# EAGLE design Telecomanda_Licenta (EAGLE 9.6.2)
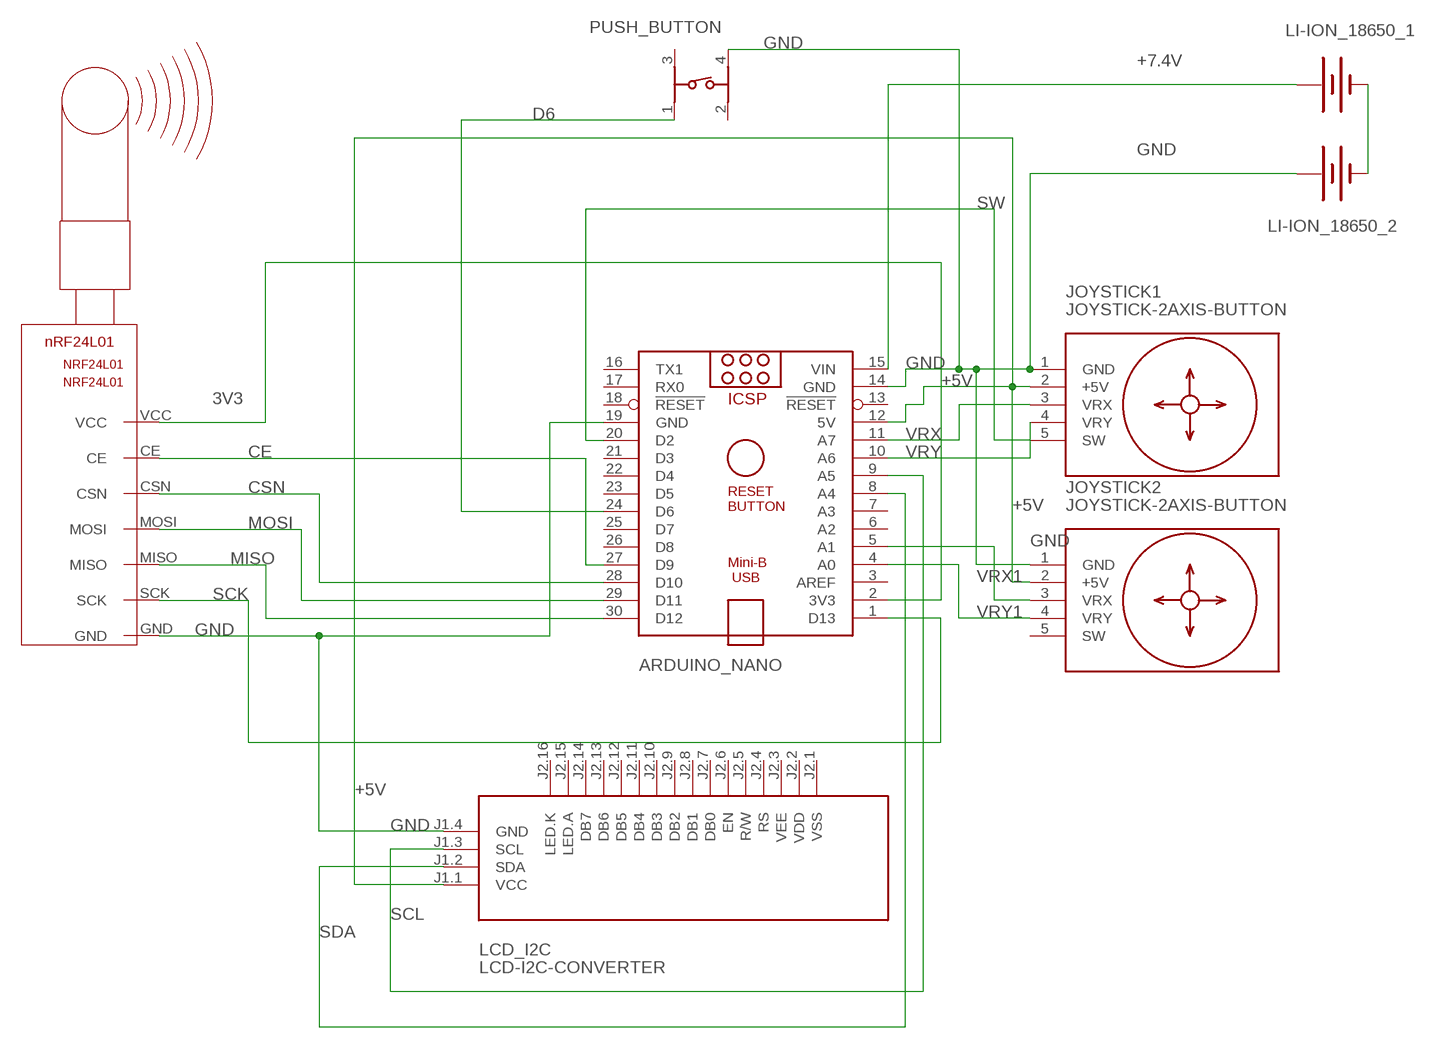
[diagram p0: schematic, sheet 1]

## Parts
ARDUINO_NANO  ARDUINO_NANO  [ARDUINO_NANO]
JOYSTICK1  JOYSTICK-2AXIS-BUTTON  [JOYSTICK-2AXIS-BUTTON]
JOYSTICK2  JOYSTICK-2AXIS-BUTTON  [JOYSTICK-2AXIS-BUTTON]
LCD_I2C  LCD-I2C-CONVERTER  [LCD-I2C-CONVERTER]
LI-ION_18650_1  BATTERY-18650  [BATTERY_18650-HOLDER]
LI-ION_18650_2  BATTERY-18650  [BATTERY_18650-HOLDER]
NRF24L01  NRF24L01  [NRF24L01]
PUSH_BUTTON  430152050836  [430152050836]

## Nets
3V3: ARDUINO_NANO.2(3V3) NRF24L01.VCC
+5V: ARDUINO_NANO.12(5V) JOYSTICK1.2(+5V) JOYSTICK2.2(+5V) LCD_I2C.J1.1(VCC)
+7.4V: ARDUINO_NANO.15(VIN) LI-ION_18650_1.PWR@1(+)
CE: ARDUINO_NANO.27(D9) NRF24L01.CE
CSN: ARDUINO_NANO.28(D10) NRF24L01.CSN
D6: ARDUINO_NANO.24(D6) PUSH_BUTTON.1
GND: ARDUINO_NANO.14(GND) ARDUINO_NANO.19(GND) JOYSTICK1.1(GND) JOYSTICK2.1(GND) LCD_I2C.J1.4(GND) LI-ION_18650_2.PWR@1(+) NRF24L01.GND PUSH_BUTTON.4
MISO: ARDUINO_NANO.30(D12) NRF24L01.MISO
MOSI: ARDUINO_NANO.29(D11) NRF24L01.MOSI
N$19: LI-ION_18650_1.GND@1(-) LI-ION_18650_2.GND@1(-)
SCK: ARDUINO_NANO.1(D13) NRF24L01.SCK
SCL: ARDUINO_NANO.9(A5) LCD_I2C.J1.3(SCL)
SDA: ARDUINO_NANO.8(A4) LCD_I2C.J1.2(SDA)
SW: ARDUINO_NANO.20(D2) JOYSTICK1.5(SW)
VRX: ARDUINO_NANO.11(A7) JOYSTICK1.3(VRX)
VRX1: ARDUINO_NANO.5(A1) JOYSTICK2.3(VRX)
VRY: ARDUINO_NANO.10(A6) JOYSTICK1.4(VRY)
VRY1: ARDUINO_NANO.4(A0) JOYSTICK2.4(VRY)
Unconnected: ARDUINO_NANO.3(AREF) ARDUINO_NANO.6(A2) ARDUINO_NANO.7(A3) ARDUINO_NANO.13(!RESET) ARDUINO_NANO.16(TX1) ARDUINO_NANO.17(RX0) ARDUINO_NANO.18(!RESET) ARDUINO_NANO.21(D3) ARDUINO_NANO.22(D4) ARDUINO_NANO.23(D5) ARDUINO_NANO.25(D7) ARDUINO_NANO.26(D8) JOYSTICK2.5(SW) LCD_I2C.J2.1(VSS) LCD_I2C.J2.2(VDD) LCD_I2C.J2.3(VEE) LCD_I2C.J2.4(RS) LCD_I2C.J2.5(R/W) LCD_I2C.J2.6(EN) LCD_I2C.J2.7(DB0) LCD_I2C.J2.8(DB1) LCD_I2C.J2.9(DB2) LCD_I2C.J2.10(DB3) LCD_I2C.J2.11(DB4) LCD_I2C.J2.12(DB5) LCD_I2C.J2.13(DB6) LCD_I2C.J2.14(DB7) LCD_I2C.J2.15(LED.A) LCD_I2C.J2.16(LED.K) PUSH_BUTTON.2 PUSH_BUTTON.3

## Library data of the parts
ARDUINO_NANO = ArduinoNanoV30:ARDUINO_NANO: Arduino Nano V3.0 Overview: The Arduino Nano is a small, complete, and breadboard-friendly board based on the ATmega328 (Arduino Nano 3.x) or ATmega168 (Arduino Nano 2.x). It has more or less the same functionality of the Arduino Duemilanove, but in a different package. It lacks only a DC power jack, and works with a Mini-B USB cable instead of a standard one. The Nano was designed and is being produced by Gravitech. Specifications: Microcontroller Atmel ATmega168 or ATmega328 Operating Voltage (logic level) 5 V Input Voltage (recommended) 7-12 V Input Voltage (limits) 6-20 V Digital I/O Pins 14 (of which 6 provide PWM output) Analog Input Pins 8 DC Current per I/O Pin 40 mA Flash Memory 16 KB (ATmega168) or 32 KB (ATmega328) of which 2 KB used by bootloader SRAM 1 KB (ATmega168) or 2 KB (ATmega328) EEPROM 512 bytes (ATmega168) or 1 KB (ATmega328) Clock Speed 16 MHz Dimensions 0.73" x 1.70" Length 45 mm Width 18 mm Weigth 5 g Power: The Arduino Nano can be powered via the Mini-B USB connection, 6-20V unregulated external power supply (pin 30), or 5V regulated external power supply (pin 27). The power source is automatically selected to the highest voltage source. Memory: The ATmega168 has 16 KB of flash memory for storing code (of which 2 KB is used for the bootloader); the ATmega328 has 32 KB, (also with 2 KB used for the bootloader). The ATmega168 has 1 KB of SRAM and 512 bytes of EEPROM (which can be read and written with the EEPROM library); the ATmega328 has 2 KB of SRAM and 1 KB of EEPROM. Input and Output: Each of the 14 digital pins on the Nano can be used as an input or output, using pinMode(), digitalWrite(), and digitalRead() functions. They operate at 5 volts. Each pin can provide or receive a maximum of 40 mA and has an internal pull-up resistor (disconnected by default) of 20-50 kOhms. In addition, some pins have specialized functions. Visit Arduino - ArduinoBoardNano <https://www.arduino.cc/en/Main/ArduinoBoardNano>
JOYSTICK1 JOYSTICK2 = diy-modules (3):JOYSTICK-2AXIS-BUTTON: 2-Axis Analog Joystick with Push Button Tutorial is available here: http://henrysbench.capnfatz.com/henrys-bench/arduino-sensors-and-input/arduino-ps2-joystick-tutorial-keyes-ky-023-deek-robot/ Click here to find device on ebay.com <http://www.ebay.com/sch/joystick+ps2+module>
LCD_I2C = diy-modules (3):LCD-I2C-CONVERTER: I2C Bus to 4-Bit Parallel LCD Interface with LED backlight driver
LI-ION_18650_1 LI-ION_18650_2 = SparkFun-Batteries:BATTERY: Battery - Single Cell A variety of battery chemistries, sizes, and footprints. Device List: 20MM_PTH - Coin Cell Battery Holder - 20mm (PTH) <https://www.sparkfun.com/products/783> 6.8MM_PTH - Coin Cell Battery Holder - 6.8MM(SMD) <https://www.digikey.com/product-detail/en/seiko-instruments/MS621FE-FL11E/728-1057-ND/1889208?WT.srch=1&gclid=CNOQ5a6LzdQCFZS2wAodXCkE0g> 12MM_SMD - Coin Cell Battery Holder - 12mm (SMD) <https://www.sparkfun.com/products/10592> 12MM_PTH - Coin Cell Battery Holder - 12mm (PTH) <https://www.sparkfun.com/products/7948> 20MM_SMD - 20mm Coin Cell Battery Holder (SMD) (2 legs) Used on the Big Time Watch Kit <https://www.sparkfun.com/products/11734> 20MM_SMD_4LEGS - Coin Cell Battery Holder - 20mm (SMD) <https://www.sparkfun.com/products/11892> 20MM_SMD_4LEGS_OVERPASTE - Coin Cell Battery Holder - 20mm (SMD) <https://www.sparkfun.com/products/11892> (Over-paste on the legs) 24.5MM_PTH - Coin Cell Battery Holder - 24.5mm (PTH) <https://www.sparkfun.com/products/8863> 9V - 9V Battery Holder - PC Mount Used on the SparkFun SparkPunk Sound Kit <https://www.sparkfun.com/products/11177> and SparkFun SparkPunk Sequencer Kit <https://www.sparkfun.com/products/12707> 18650 - Battery Holder - 18650 (PTH) <https://www.sparkfun.com/products/13113> AA - Battery Holder - 1xAA (PTH) <https://www.sparkfun.com/products/7949> AAA - Battery Holder - 1xAAA (PTH) <https://www.sparkfun.com/products/12718> AA_KIT - Battery Holder - 1xAA (PTH) <https://www.sparkfun.com/products/7949> Special kit package - pads only have exposed copper on one side of the board. AAA_KIT - Battery Holder - 1xAAA (PTH) <https://www.sparkfun.com/products/12718> Special kit package - pads only have exposed copper on one side of the board.; PROD_ID: BATT-12327; SF_SKU: PRT-13113
NRF24L01 = Clean-Kong (1):NRF24L01: nrF54L01 2.4GHz with 100 Channels Emitter/Reveiver SPI Controlled Roboshop / Minint
PUSH_BUTTON = Wurth_Switch_WS-TASV:430152050836: WS-TASV SMT Tact Switch 6x6 mm Material Properties Cover Material : Stainless Steel Properties Actuator Material:LCP Actuator Flammability :UL94 V-0 Rating Actuator Color:Black; Salmon; White Frame Material:LCP Flammability Rating:UL94 V-0 Frame Color:Black Contact Material:Stainless Steel Contact Plating:Silver Terminal Material:Copper Alloy Terminal Plating:Silver VR:12 V (DC) Contact Resistance Initial:100 mΩ Contact Resistance After Life Test:2Ω RISO:100 MΩ Withstanding Voltage:250 V (AC) Washable:No Qty.:4000;5000 Mechanical Properties Electrical Life:400; 550; 1000 Stroke :0.25 mm General Information Operating Temperature:-40 up to +85 °C Washable:No Packaging Properties Packaging:Tape and Reel <https://www.we-online.com/catalog/media/o37470v209%20Family_WS-TASV_6x6mm_SMD_Tact_Switch_4301820xx8xx.jpg> Details see: https://www.we-online.com/catalog/en/TASV_6X6_SMD/ Updated by yingchun,Shan;2020-02-18 2020(C) Würth Elektronik; DATASHEET-URL: https://www.we-online.com/catalog/datasheet/430152050836.pdf; H: 5mm; OPERATION-FORCE: 360g; PART-NUMBER: 430152050836; QTY: 1000

## Board
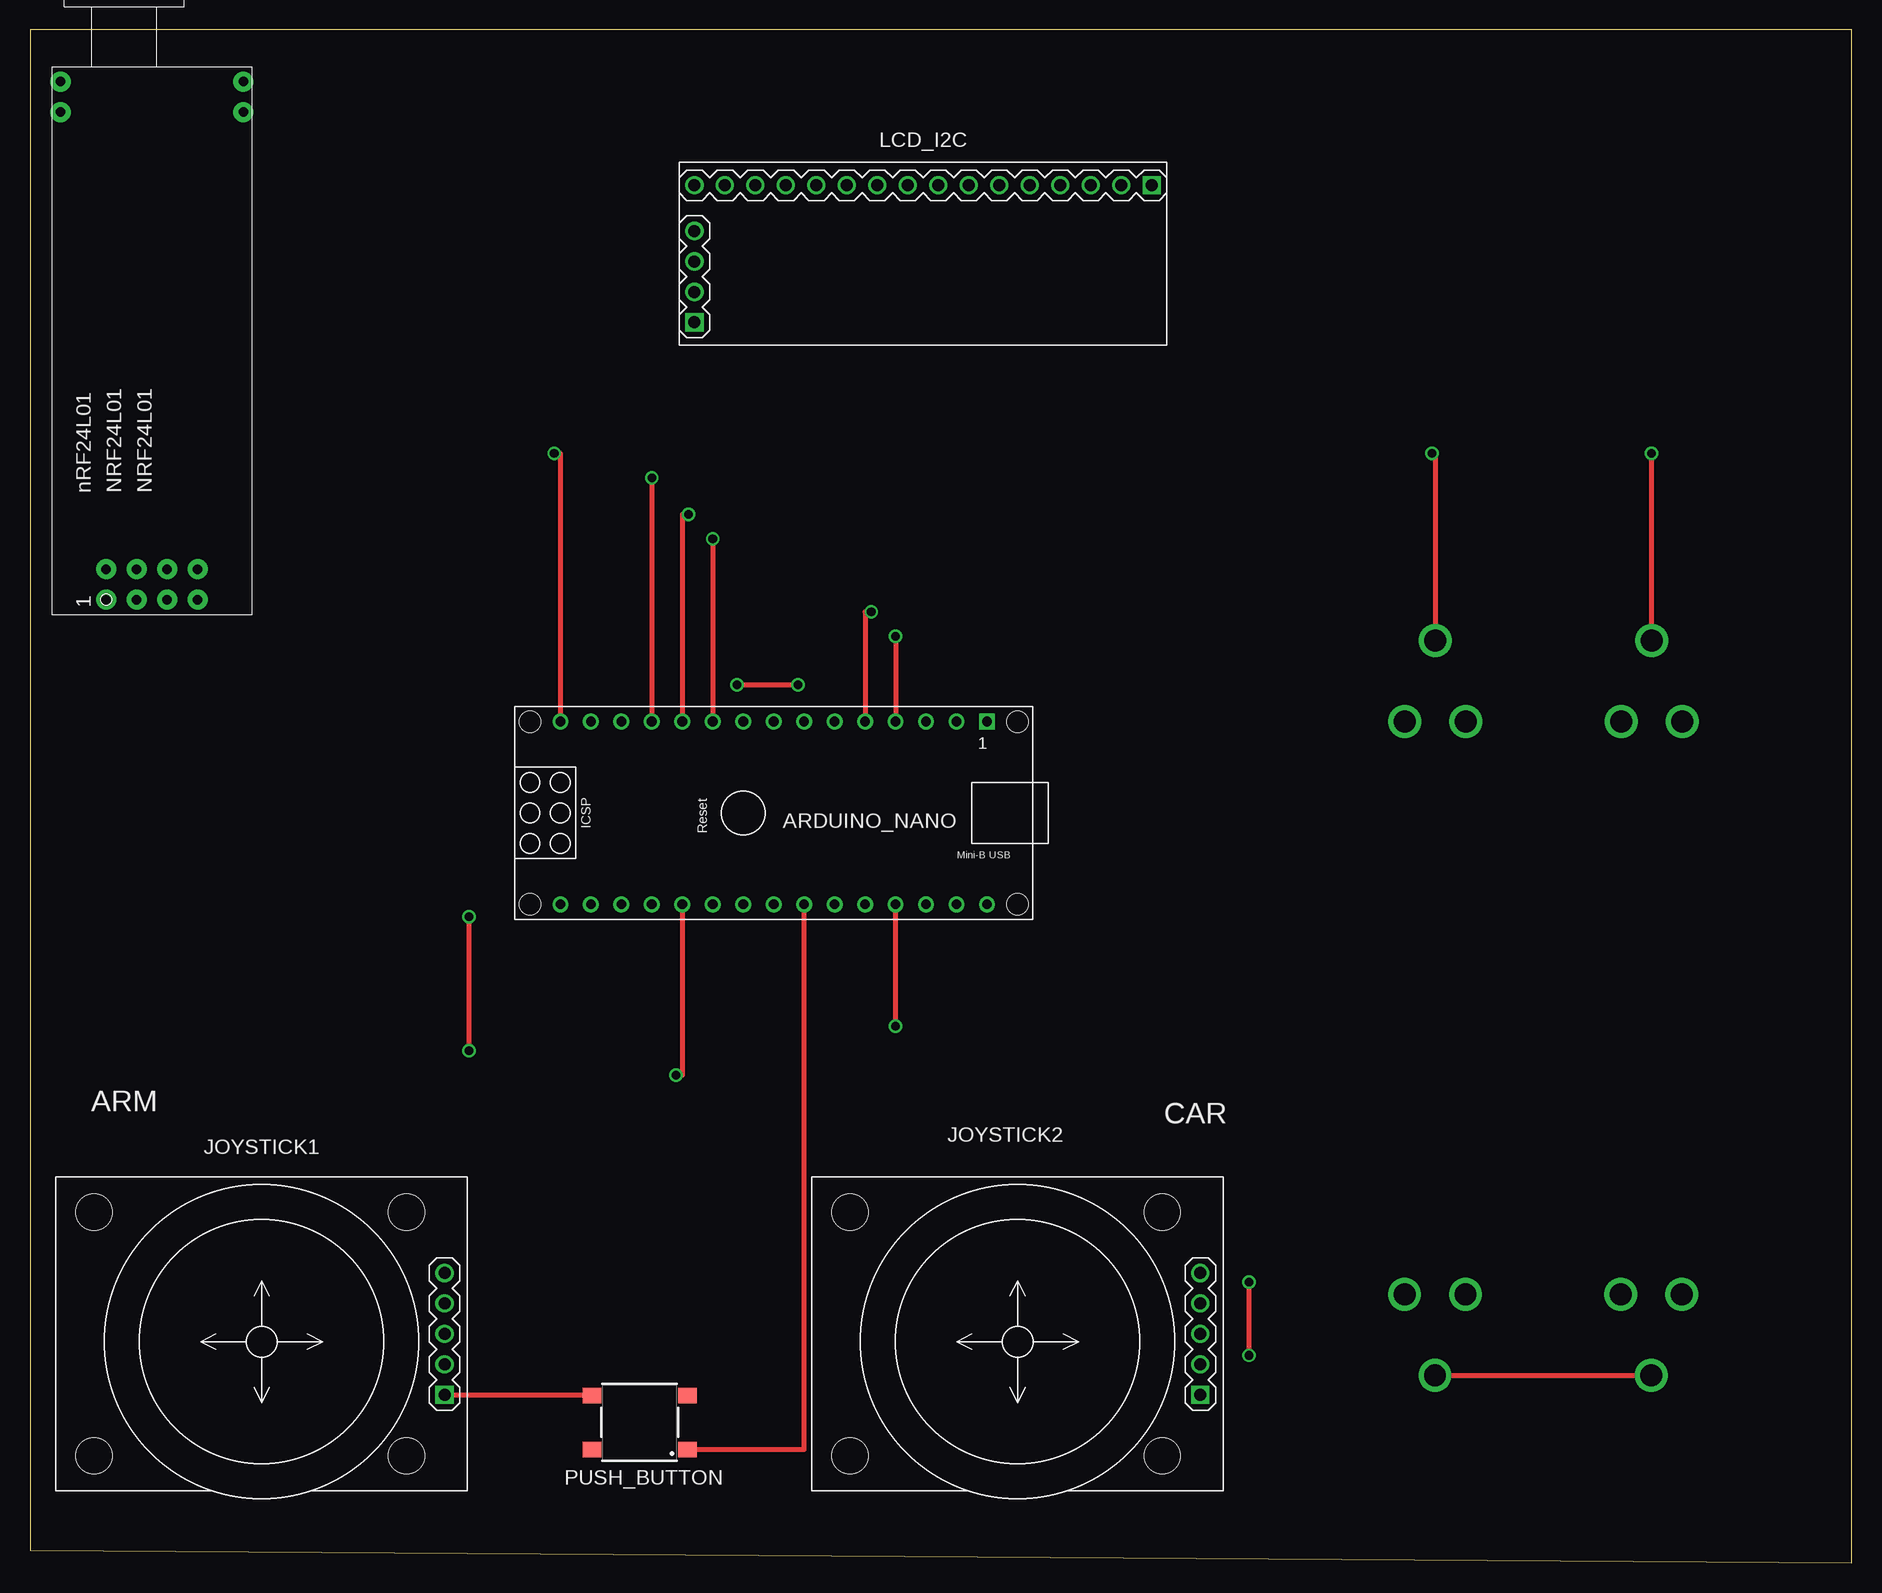
[diagram p1: board, top side]
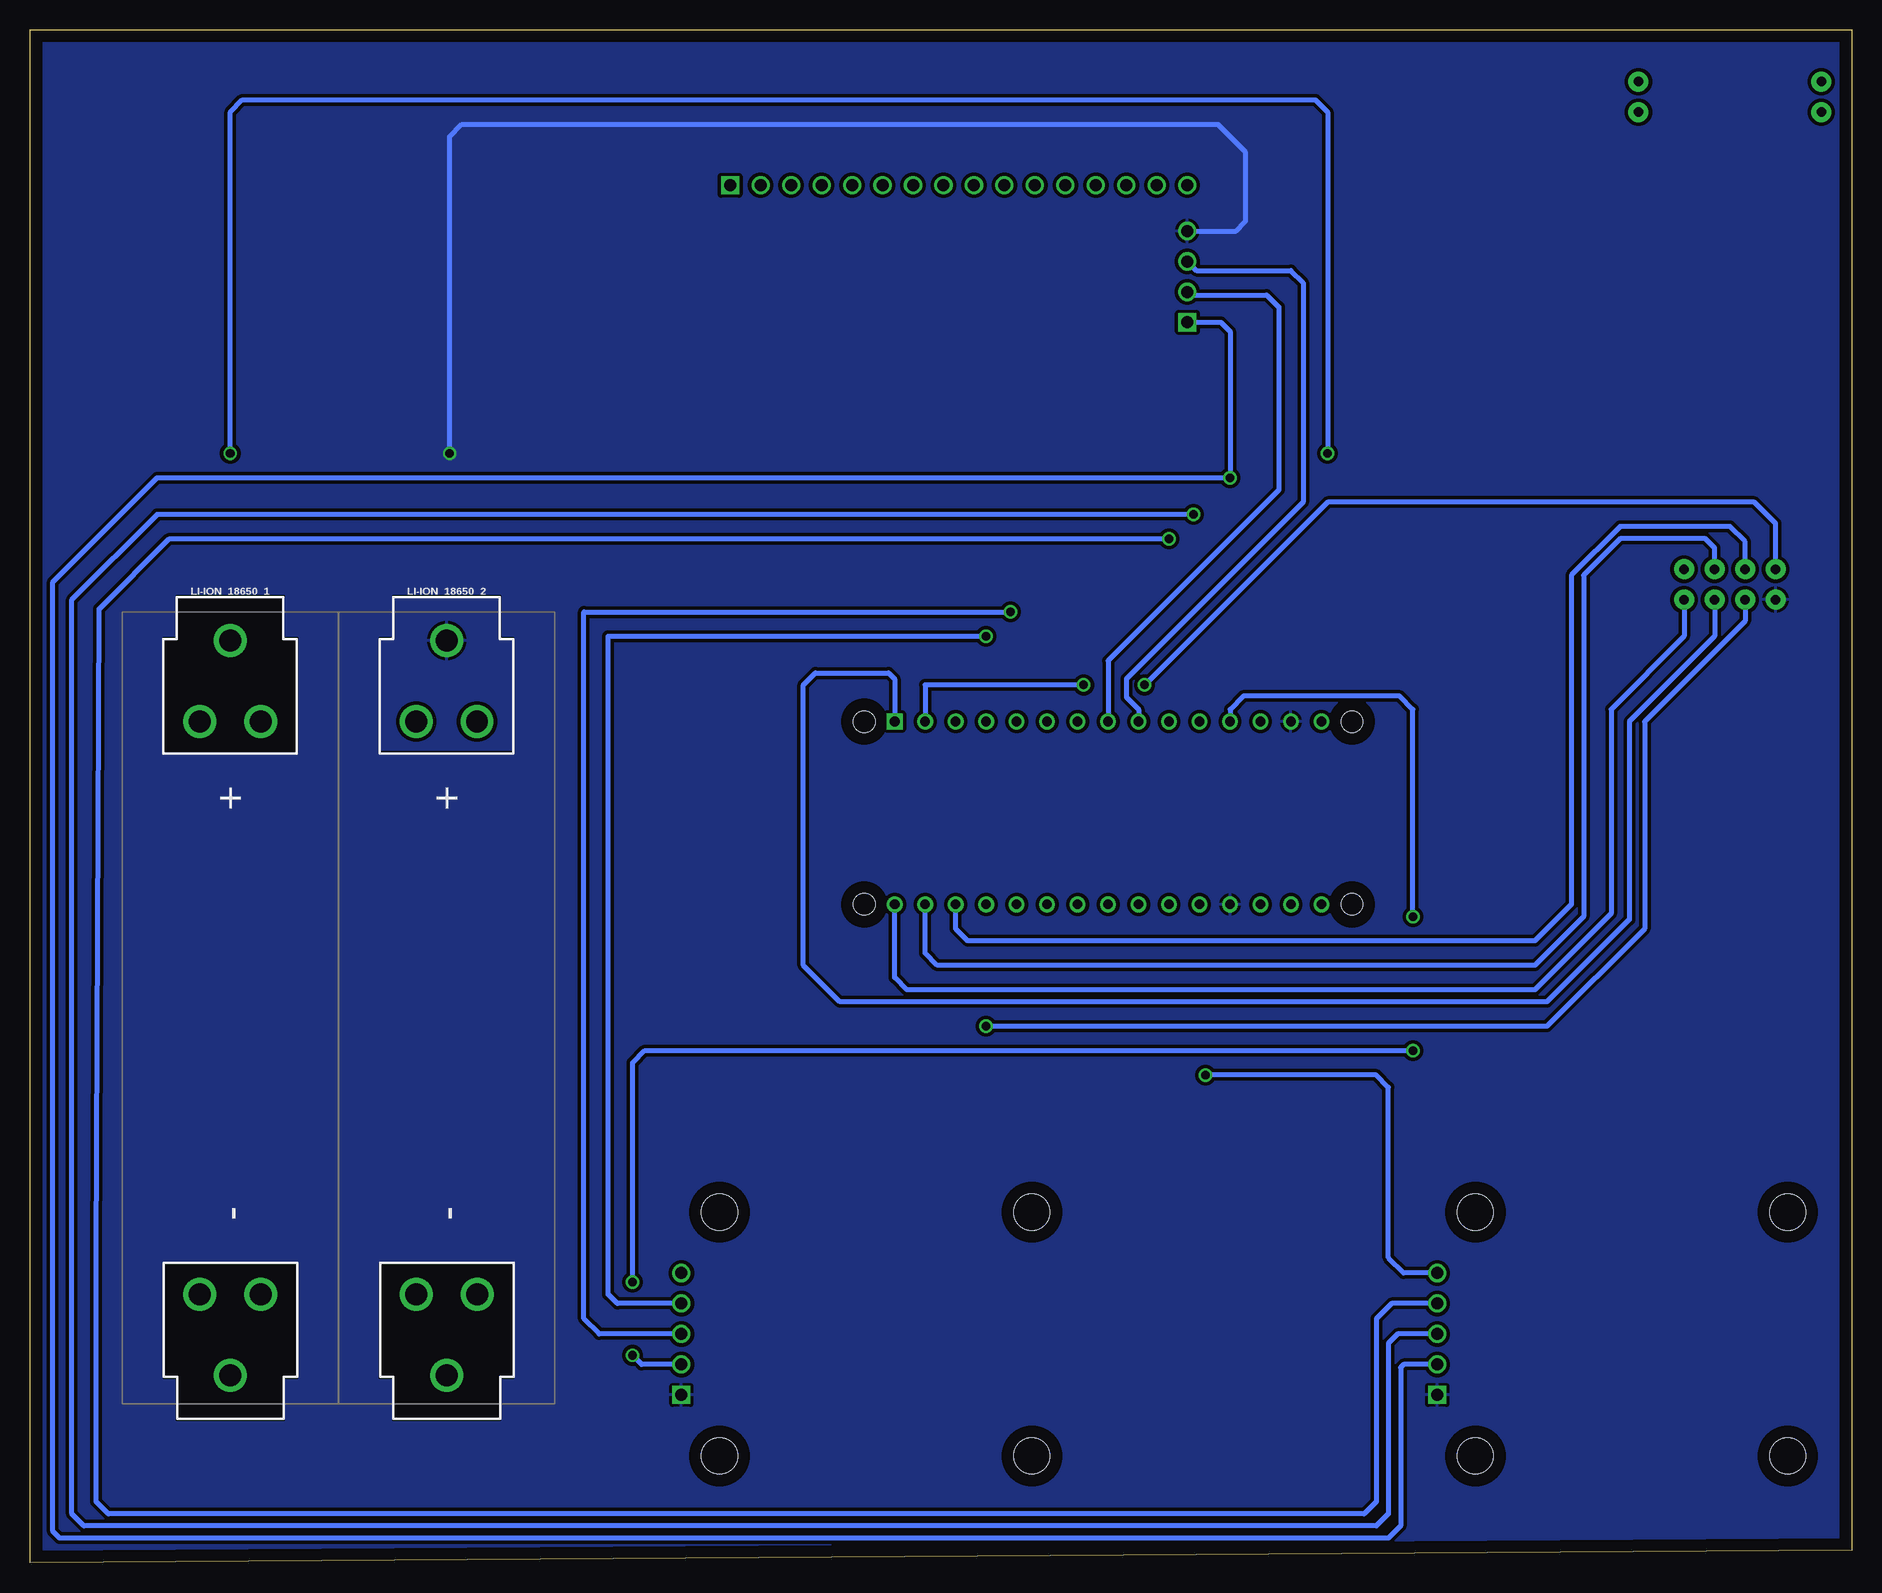
[diagram p2: board, bottom side, seen from below]

Size 151.82 x 127.75 mm. Coordinates in mm from the lower left corner, seen from the top.
Outline: 0,1.02 151.82,0 151.82,127.75 0,127.75 0,1.02
Copper layers (1*16): Top 0.035mm / dielectric 1.5mm / Bottom 0.035mm
Design rules "default *": minimum track width 0.8mm, minimum drill 0.35mm, track to track 0.3mm, track to pad 0.3mm, pad to pad 0.3mm, via to via 0.3mm, smd to smd 0.3mm, copper to edge 40mil, drill to drill 6mil, minimum pad ring 10mil, minimum via ring 8mil, stop-mask expansion 4mil, vias tented up to drill 0mil, thermal gap 10mil

### Footprints (pad centres in the part's own frame; a part is rotated, then mirrored left to right if it is on the bottom)
ARDUINO_NANO = drill 0.8 square: 1 -20.32,-7.62 | drill 0.8: 2 -17.78,-7.62; 3 -15.24,-7.62; 4 -12.7,-7.62; 5 -10.16,-7.62; 6 -7.62,-7.62; 7 -5.08,-7.62; 8 -2.54,-7.62; 9 0,-7.62; 10 2.54,-7.62; 11 5.08,-7.62; 12 7.62,-7.62; 13 10.16,-7.62; 14 12.7,-7.62; 15 15.24,-7.62; 16 15.24,7.62; 17 12.7,7.62; 18 10.16,7.62; 19 7.62,7.62; 20 5.08,7.62; 21 2.54,7.62; 22 0,7.62; 23 -2.54,7.62; 24 -5.08,7.62; 25 -7.62,7.62; 26 -10.16,7.62; 27 -12.7,7.62; 28 -15.24,7.62; 29 -17.78,7.62; 30 -20.32,7.62 | hole 1.778: -22.86,-7.62; -22.86,7.62; 17.78,7.62; 17.78,-7.62
JOYSTICK-2AXIS-BUTTON = drill 1 square: 1 -15.24,5.08 | drill 1: 2 -15.24,2.54; 3 -15.24,0; 4 -15.24,-2.54; 5 -15.24,-5.08 | hole 3: -12.065,10.16; -12.065,-10.16; 13.97,-10.16; 13.97,10.16
LCD-I2C-CONVERTER = drill 1 square: J1.1 -19.05,-5.08; J2.1 19.05,6.35 | drill 1: J1.2 -19.05,-2.54; J1.3 -19.05,0; J1.4 -19.05,2.54; J2.2 16.51,6.35; J2.3 13.97,6.35; J2.4 11.43,6.35; J2.5 8.89,6.35; J2.6 6.35,6.35; J2.7 3.81,6.35; J2.8 1.27,6.35; J2.9 -1.27,6.35; J2.10 -3.81,6.35; J2.11 -6.35,6.35; J2.12 -8.89,6.35; J2.13 -11.43,6.35; J2.14 -13.97,6.35; J2.15 -16.51,6.35; J2.16 -19.05,6.35
BATTERY_18650-HOLDER = drill 1.829: GND@1 30.628,0.01; GND@2 23.88,2.55; GND@3 23.88,-2.53; PWR@1 -30.628,-0.01; PWR@2 -23.88,2.53; PWR@3 -23.88,-2.55
NRF24L01 = drill 0.8 pad 1.676: CE 0,-2.54; CSN 2.54,-2.54; GND 0,0; MISO 0,-7.62; MOSI 2.54,-5.08; P$1 40.64,-11.43; P$2 43.18,-11.43; P$3 43.18,3.81; P$4 40.64,3.81; P$8 2.54,-7.62; SCK 0,-5.08; VCC 2.54,0
430152050836 = smd 1.55 x 1.3: 1 -3.975,2.25; 2 -3.975,-2.25; 3 3.975,2.25; 4 3.975,-2.25

### Placement (x,y rotation side)
ARDUINO_NANO  59.44,62.48 180 top
JOYSTICK1  19.3,19.05 180 top
JOYSTICK2  82.3,19.05 180 top
LCD_I2C  74.42,108.46 0 top
LI-ION_18650_1  135.13,46.23 270 bottom
LI-ION_18650_2  117.09,46.23 270 bottom
NRF24L01  6.35,80.26 90 top
PUSH_BUTTON  50.8,11.68 180 top

### Tracks (layer width: path | path; a pad name or v marks a point on that pad's centre or on a via)
3V3  (via drill 0.71 pad 1.12)
  Top 0.406: v64.01,73.15 v58.93,73.15
  Bottom 0.406: NRF24L01.VCC 6.35,86.61 8.13,88.39 43.69,88.39 v58.93,73.15 | v64.01,73.15 77.22,73.15 ARDUINO_NANO.2
+5V  (via drill 0.71 pad 1.12)
  Top 0.406: v51.82,90.42 ARDUINO_NANO.12 | v36.58,53.85 v36.58,42.67 | v101.6,17.27 v101.6,23.37
  Bottom 0.406: LCD_I2C.J1.1 52.58,103.38 51.82,102.62 v51.82,90.42 141.22,90.42 149.91,81.73 149.91,2.59 149.35,2.03 38.61,2.03 37.59,3.05 37.59,16.26 37.34,16.51 JOYSTICK1.2 | v36.58,53.85 36.58,71.12 37.67,72.21 50.72,72.21 51.82,71.12 ARDUINO_NANO.12 | JOYSTICK2.2 100.84,16.51 v101.6,17.27 | v101.6,23.37 101.6,41.66 100.58,42.67 v36.58,42.67
+7.4V  (via drill 0.71 pad 1.12)
  Top 0.406: LI-ION_18650_1.PWR@1 v135.14,92.45 v135.13,92.46 | v43.69,92.46 44.2,92.46 ARDUINO_NANO.15
  Bottom 0.406: v135.13,92.46 135.13,120.9 134.11,121.92 44.7,121.92 43.69,120.9 v43.69,92.46
CE  (via drill 0.71 pad 1.12)
  Top 0.406: v72.14,44.7 ARDUINO_NANO.27
  Bottom 0.406: NRF24L01.CE 8.89,78.49 17.27,70.1 17.27,52.83 25.4,44.7 v72.14,44.7
CSN
  Bottom 0.406: NRF24L01.CSN 8.89,85.09 10.16,86.36 19.3,86.36 23.37,82.3 23.37,54.86 26.42,51.82 73.66,51.82 74.68,52.83 ARDUINO_NANO.28
D6
  Top 0.406: PUSH_BUTTON.1 64.52,9.43 ARDUINO_NANO.24
GND  (via drill 0.71 pad 1.12)
  Top 0.406: 46.74,14.02 PUSH_BUTTON.4 46.79,13.97 JOYSTICK1.1 | v116.84,92.46 117.1,92.46 LI-ION_18650_2.PWR@1
  Bottom 0.406: v116.84,92.46 116.84,118.87 115.82,119.89 52.83,119.89 50.55,117.6 50.55,111.76 51.31,111 LCD_I2C.J1.4
  pour Bottom: 0,128.02 0,1.02 152.4,1.02 152.4,128.02
MISO
  Bottom 0.406: NRF24L01.MISO 13.97,77.22 20.07,71.12 20.07,54.1 26.42,47.75 78.74,47.75 79.76,48.77 ARDUINO_NANO.30
MOSI
  Bottom 0.406: NRF24L01.MOSI 11.43,84.58 12.19,85.34 19.3,85.34 22.35,82.3 22.35,53.85 26.42,49.78 76.2,49.78 77.22,50.8 ARDUINO_NANO.29
N$19
  Top 0.406: LI-ION_18650_2.GND@1 LI-ION_18650_1.GND@1
SCK
  Bottom 0.406: NRF24L01.SCK 11.43,77.22 18.54,70.1 18.54,53.59 25.4,46.74 84.33,46.74 87.38,49.78 87.38,73.15 86.36,74.17 80.26,74.17 79.76,73.66 ARDUINO_NANO.1
SCL
  Bottom 0.406: ARDUINO_NANO.9 59.44,71.12 60.45,72.14 60.45,73.66 45.72,88.39 45.72,106.68 46.74,107.7 54.61,107.7 LCD_I2C.J1.3
SDA
  Bottom 0.406: ARDUINO_NANO.8 61.98,75.18 47.75,89.41 47.75,104.65 48.77,105.66 55.12,105.66 LCD_I2C.J1.2
SW  (via drill 0.71 pad 1.12)
  Top 0.406: ARDUINO_NANO.20 54.36,40.64 v53.85,40.64
  Bottom 0.406: JOYSTICK1.5 37.34,24.13 38.61,25.4 38.61,39.62 39.62,40.64 v53.85,40.64
VRX  (via drill 0.71 pad 1.12)
  Top 0.406: ARDUINO_NANO.11 54.36,87.38 v54.86,87.38
  Bottom 0.406: v54.86,87.38 141.22,87.38 148.34,80.26 148.34,4.06 147.32,3.05 39.62,3.05 38.61,4.06 38.61,18.29 37.85,19.05 JOYSTICK1.3
VRX1  (via drill 0.71 pad 1.12)
  Top 0.406: v70.1,79.25 69.6,79.25 ARDUINO_NANO.5
  Bottom 0.406: JOYSTICK2.3 104.39,19.05 105.66,20.32 105.66,79.25 v70.1,79.25
VRY  (via drill 0.71 pad 1.12)
  Top 0.406: v56.9,85.34 ARDUINO_NANO.10
  Bottom 0.406: v56.9,85.34 140.21,85.34 146.05,79.5 146.3,25.65 146.3,5.08 145.29,4.06 40.64,4.06 39.62,5.08 39.62,20.32 38.35,21.59 JOYSTICK1.4
VRY1  (via drill 0.71 pad 1.12)
  Top 0.406: v72.14,77.22 ARDUINO_NANO.4
  Bottom 0.406: JOYSTICK2.4 102.87,21.59 103.63,22.35 103.63,77.22 v72.14,77.22

### Text on the board
tPlace: ARM | CAR